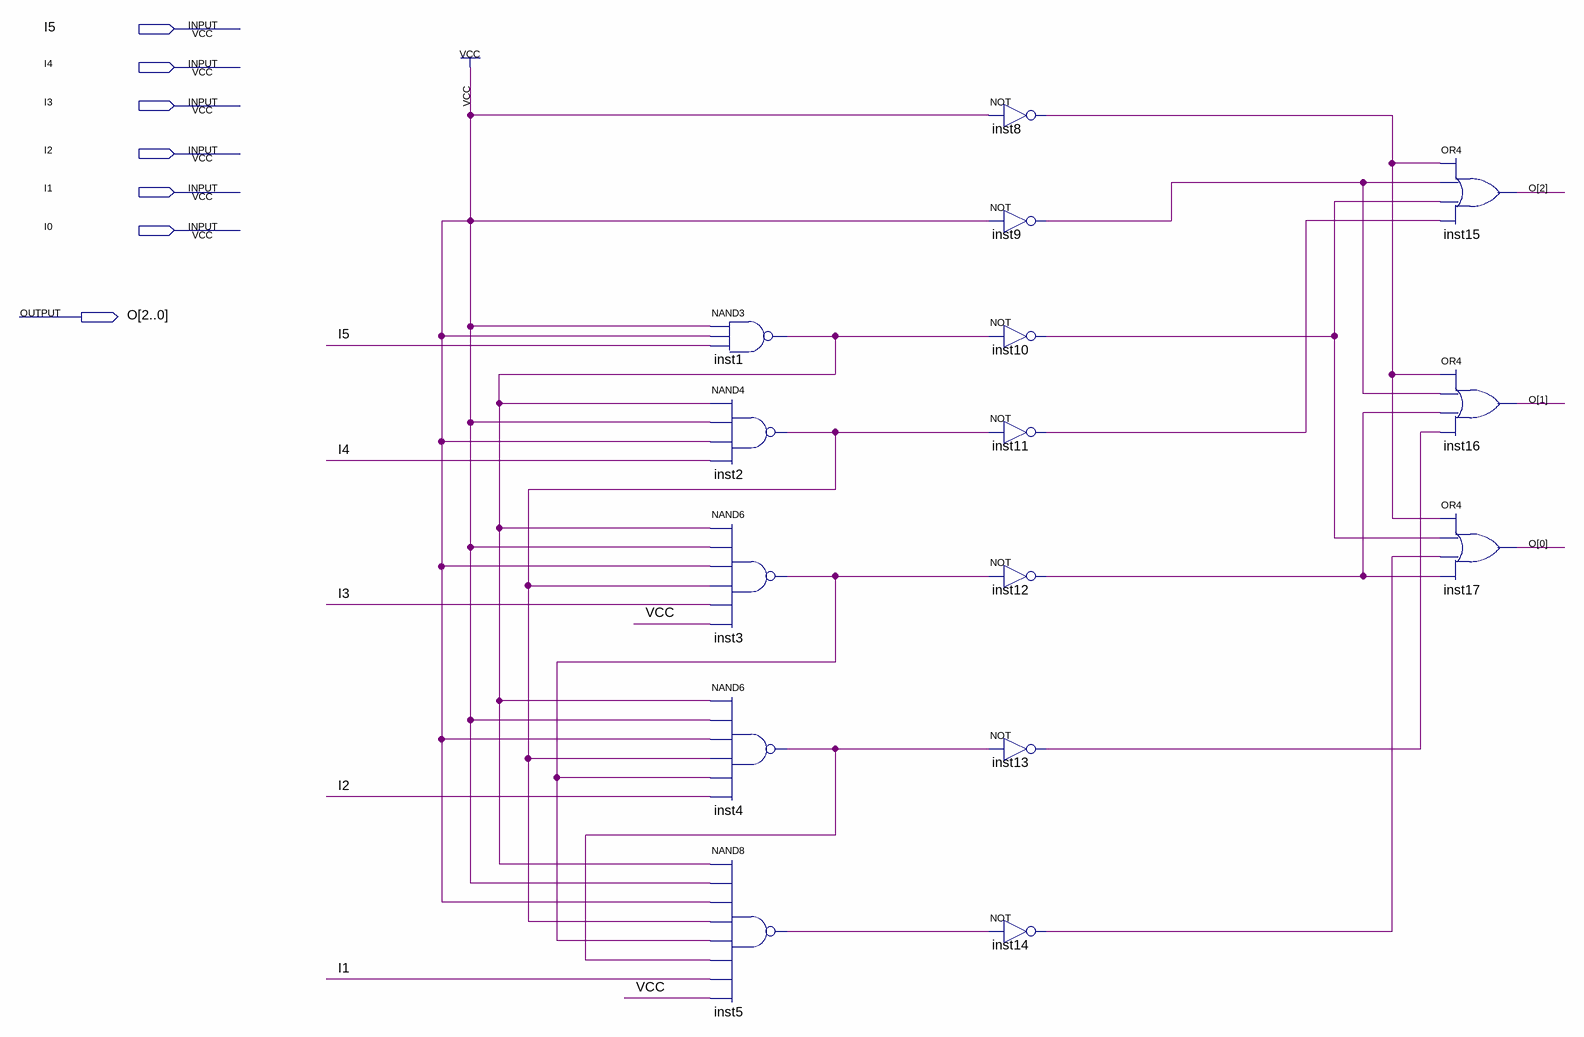
[diagram p0: schematic sheet]
// Quartus schematic Encoder.bdf as structural Verilog: 15 symbols, 7 pins
module Encoder (
  input  I5,
  input  I4,
  input  I3,
  input  I2,
  input  I1,
  input  I0,
  output [2:0] O
);

  wire inst1_out, inst2_out, inst3_out, inst4_out, inst5_out, inst8_out, inst9_out, inst10_out, inst11_out,
       inst12_out, inst13_out, inst14_out;

  nand inst1 (inst1_out, 1'b1, 1'b1, I5);
  nand inst2 (inst2_out, inst1_out, 1'b1, 1'b1, I4);
  nand inst3 (inst3_out, inst1_out, 1'b1, 1'b1, inst2_out, I3, 1'b1);
  nand inst4 (inst4_out, inst1_out, 1'b1, 1'b1, inst2_out, inst3_out, I2);
  nand inst5 (inst5_out, inst1_out, 1'b1, 1'b1, inst2_out, inst3_out, inst4_out, I1, 1'b1);
  not inst8 (inst8_out, 1'b1);
  not inst9 (inst9_out, 1'b1);
  not inst10 (inst10_out, inst1_out);
  not inst11 (inst11_out, inst2_out);
  not inst12 (inst12_out, inst3_out);
  not inst13 (inst13_out, inst4_out);
  not inst14 (inst14_out, inst5_out);
  or inst15 (O[2], inst8_out, inst9_out, inst10_out, inst11_out);
  or inst16 (O[1], inst8_out, inst9_out, inst12_out, inst13_out);
  or inst17 (O[0], inst8_out, inst10_out, inst14_out, inst12_out);
endmodule
